# Altium schematic sheet Wireless.SchDoc
size A4; SheetNumber: 1; SheetTotal: 1
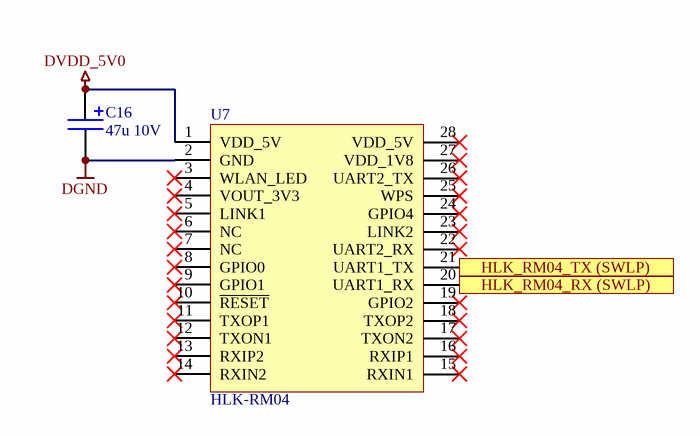
[diagram p0: Wireless.SchDoc]

## Parts
C16  47u 10V  [TECAP_TYPE_B]
U7  HLK-RM04  [HLK-RM04]

## Ports
HLK_RM04_RX (SWLP), HLK_RM04_TX (SWLP)

## Nets
DGND: C16.2(NEG) U7.2(GND)
DVDD_5V0: C16.1(POS) U7.1(VDD_5V)
HLK_RM04_RX (SWLP): U7.20(UART1_RX) ; port HLK_RM04_RX (SWLP)
HLK_RM04_TX (SWLP): U7.21(UART1_TX) ; port HLK_RM04_TX (SWLP)

Not connected (* = marked no-connect by the designer): U7 0(EP) 3(WLAN_LED)* 4(VOUT_3V3)* 5(LINK1)* 6(NC)* 7(NC)* 8(GPIO0)* 9(GPIO1)* 10(~{RESET})* 11(TXOP1)* 12(TXON1)* 13(RXIP2)* 14(RXIN2)* 15(RXIN1)* 16(RXIP1)* 17(TXON2)* 18(TXOP2)* 19(GPIO2)* 22(UART2_RX)* 23(LINK2)* 24(GPIO4)* 25(WPS)* 26(UART2_TX)* 27(VDD_1V8)* 28(VDD_5V)*

## Library data of the parts
C16 = Capacitor polar: Polarized capacitor
U7 = HLK-RM04: WIFI-UART bridge